# EAGLE design Ekogolf-board (EAGLE 9.4.2)
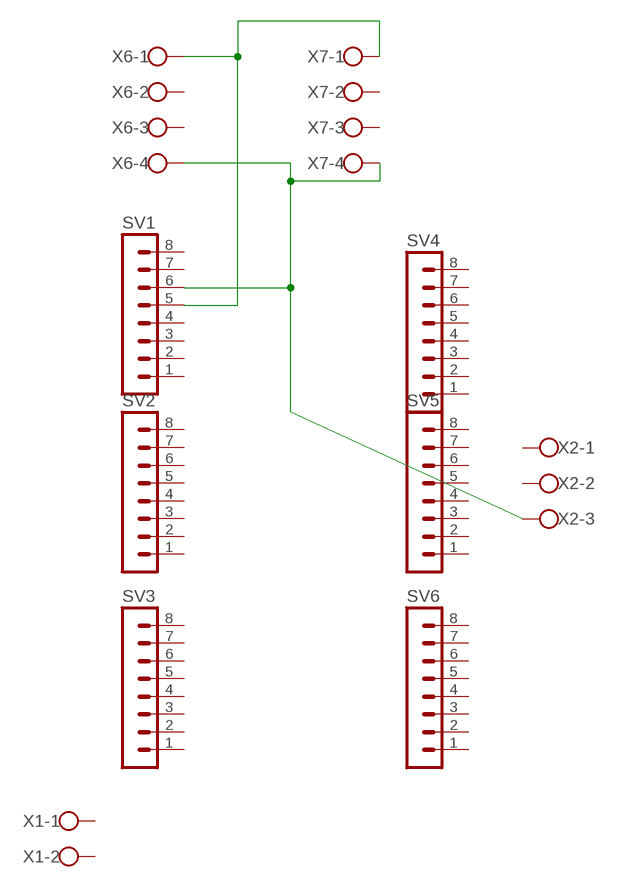
[diagram p0: schematic, sheet 1]

## Parts
SV1  MA08-1  [MA08-1]
SV2  MA08-1  [MA08-1]
SV3  MA08-1  [MA08-1]
SV4  MA08-1  [MA08-1]
SV5  MA08-1  [MA08-1]
SV6  MA08-1  [MA08-1]
X1  W237-102  [W237-102]
X2  W237-103  [W237-103]
X6  W237-4  [W237-4]
X7  W237-4  [W237-4]

## Nets
N$1: SV1.5 X6.1 X7.1
N$3: SV1.6 X2.3 X6.4 X7.4
Unconnected: SV1.1 SV1.2 SV1.3 SV1.4 SV1.7 SV1.8 SV2.1 SV2.2 SV2.3 SV2.4 SV2.5 SV2.6 SV2.7 SV2.8 SV3.1 SV3.2 SV3.3 SV3.4 SV3.5 SV3.6 SV3.7 SV3.8 SV4.1 SV4.2 SV4.3 SV4.4 SV4.5 SV4.6 SV4.7 SV4.8 SV5.1 SV5.2 SV5.3 SV5.4 SV5.5 SV5.6 SV5.7 SV5.8 SV6.1 SV6.2 SV6.3 SV6.4 SV6.5 SV6.6 SV6.7 SV6.8 X1.1 X1.2 X2.1 X2.2 X6.2 X6.3 X7.2 X7.3

## Library data of the parts
SV1-SV6 = con-lstb:MA08-1: PIN HEADER; OC_FARNELL: unknown; OC_NEWARK: unknown
X1 = con-wago-500:W237-102: WAGO SCREW CLAMP; MPN: 237-102; OC_FARNELL: unknown; OC_NEWARK: 70K9898
X2 = con-wago-500:W237-103: WAGO SCREW CLAMP; MPN: 237-103; OC_FARNELL: unknown; OC_NEWARK: 18M7116
X6 X7 = con-wago-500:W237-4: WAGO SCREW CLAMP; OC_FARNELL: unknown; OC_NEWARK: unknown

## Board
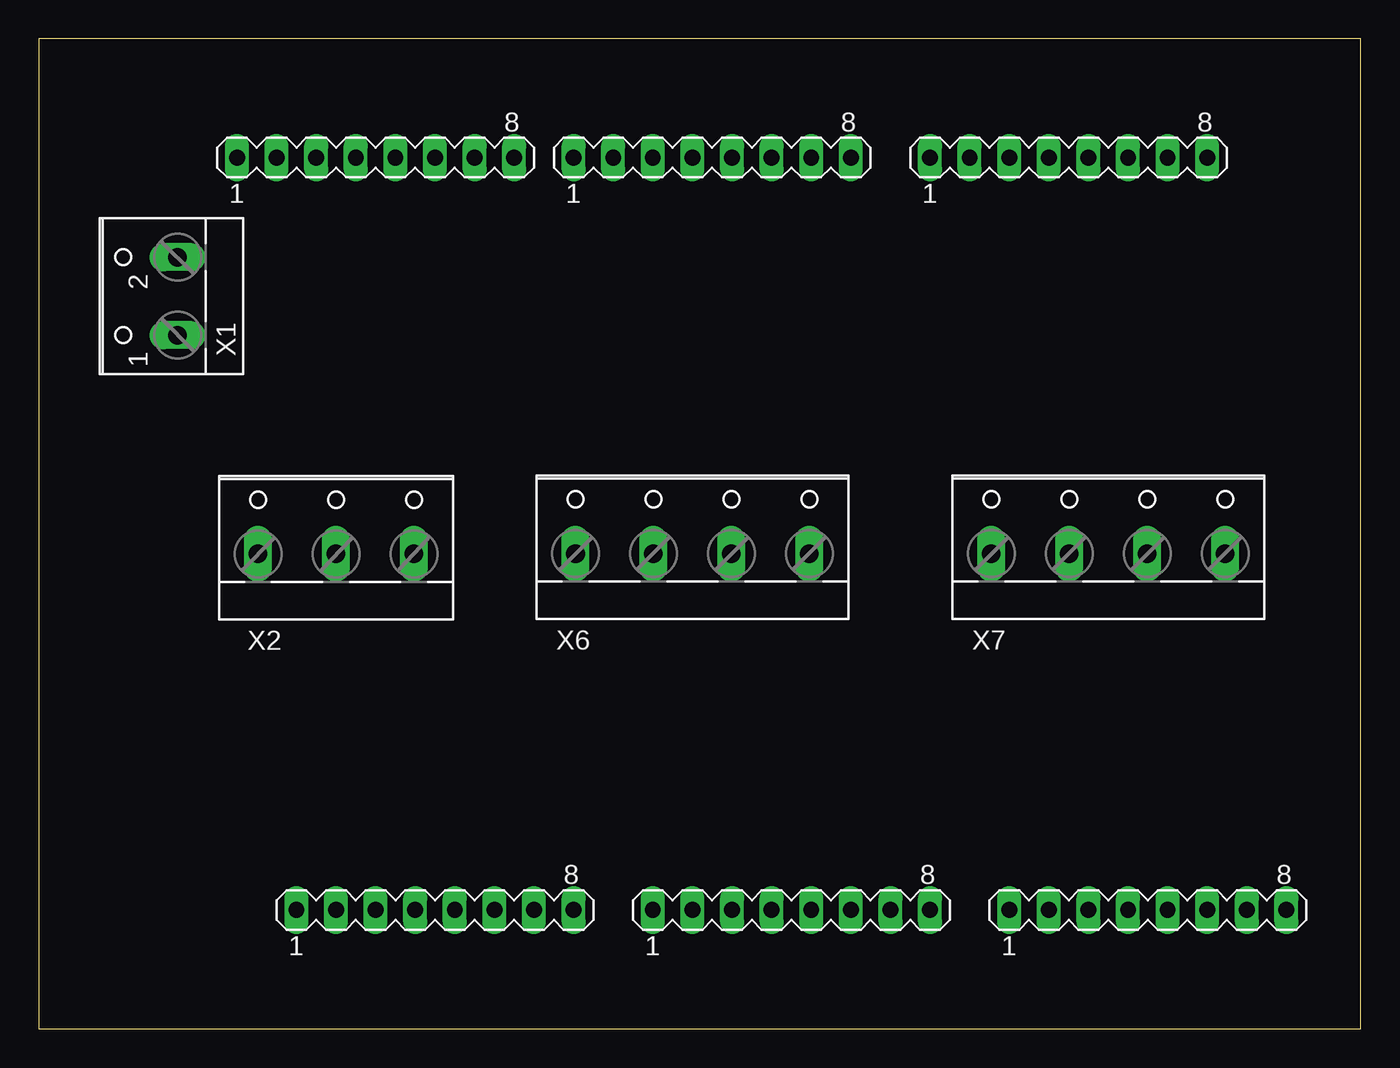
[diagram p1: board, top side]
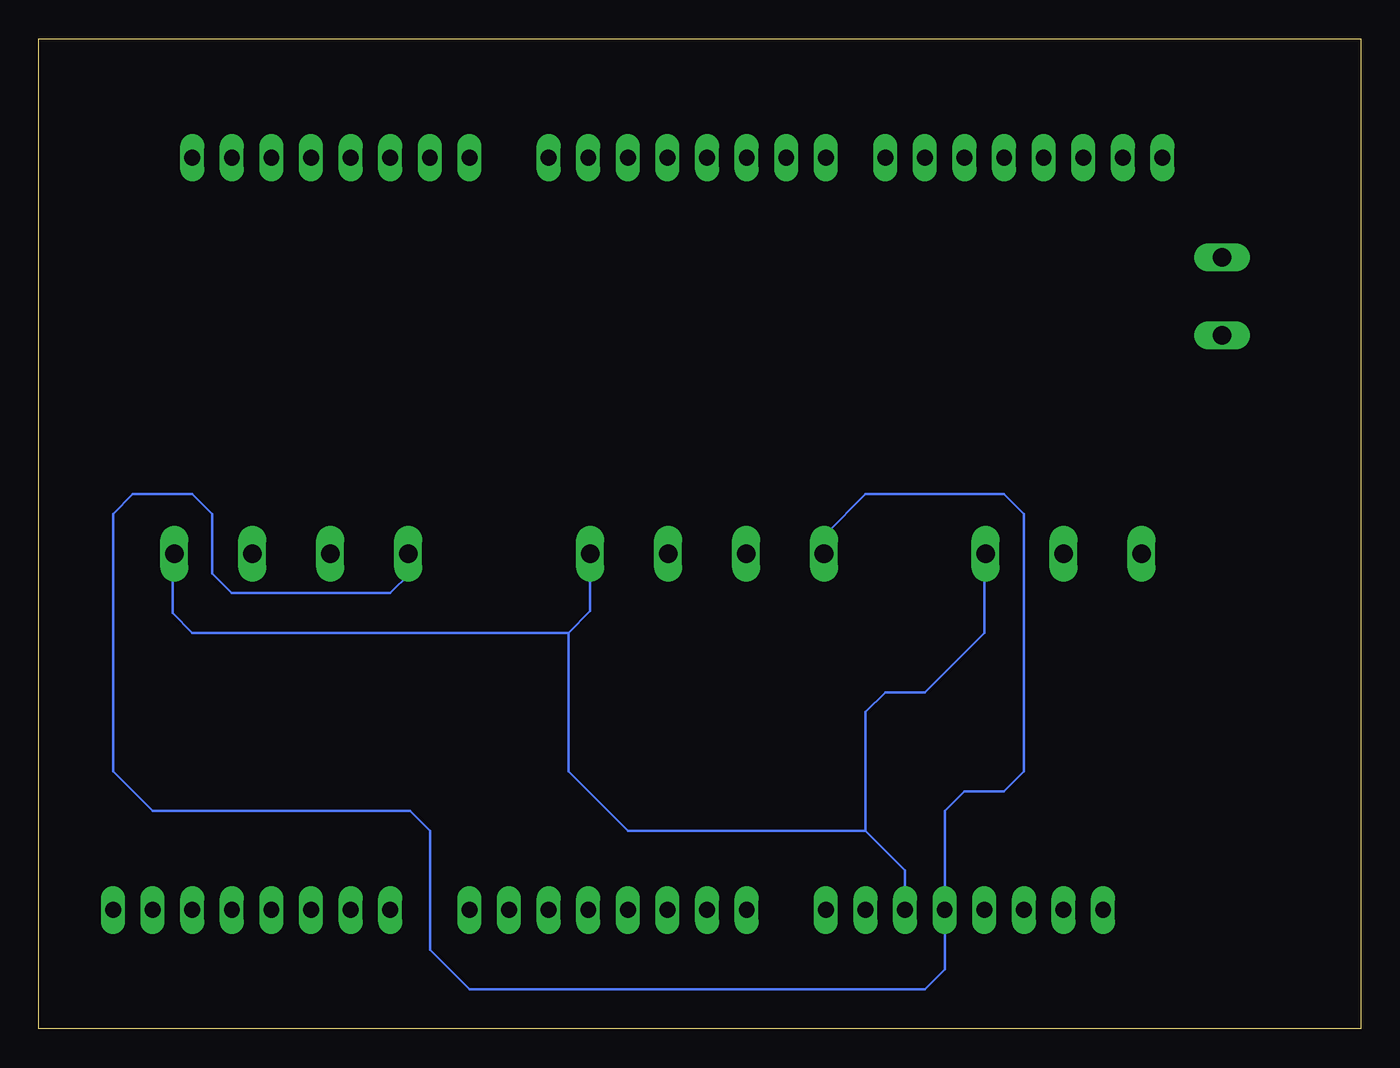
[diagram p2: board, bottom side, seen from below]

Size 84.76 x 63.49 mm. Coordinates in mm from the lower left corner, seen from the top.
Outline: 0,0 84.76,0 84.76,63.49 0,63.49 0,0
Copper layers (1*16): Top 0.035mm / dielectric 1.5mm / Bottom 0.035mm
Design rules "default": minimum track width 6mil, minimum drill 0.35mm, track to track 6mil, track to pad 6mil, pad to pad 6mil, via to via 6mil, smd to smd 6mil, copper to edge 40mil, drill to drill 6mil, minimum pad ring 10mil, minimum via ring 8mil, stop-mask expansion 4mil, vias tented up to drill 0mil, thermal gap 10mil

### Footprints (pad centres in the part's own frame; a part is rotated, then mirrored left to right if it is on the bottom)
MA08-1 = drill 1.016 long: 1 -8.89,0; 2 -6.35,0; 3 -3.81,0; 4 -1.27,0; 5 1.27,0; 6 3.81,0; 7 6.35,0; 8 8.89,0
W237-102 = drill 1.194 long: 1 -2.5,-1.27; 2 2.5,-1.27
W237-103 = drill 1.194 long: 1 -5,-1.29; 2 0,-1.29; 3 5,-1.29
W237-4 = drill 1.194 long: 1 -7.5,-1.27; 2 -2.5,-1.27; 3 2.5,-1.27; 4 7.5,-1.27

### Placement (x,y rotation side)
SV1  25.4,7.62 0 top
SV2  48.26,7.62 0 top
SV3  71.12,7.62 0 top
SV4  21.59,55.88 0 top
SV5  43.18,55.88 0 top
SV6  66.04,55.88 0 top
X1  7.62,46.99 90 top
X2  19.05,31.75 0 top
X6  41.91,31.75 0 top
X7  68.58,31.75 0 top

### Tracks (layer width: path | path; a pad name or v marks a point on that pad's centre or on a via)
N$1
  Bottom 0.152: X7.1 61.08,29.33 60.96,29.21 62.23,27.94 72.39,27.94 73.66,29.21 73.66,33.02 74.93,34.29 78.74,34.29 80.01,33.02 80.01,16.51 77.47,13.97 60.96,13.97 59.69,12.7 59.69,5.08 57.15,2.54 27.94,2.54 26.67,3.81 SV1.5 26.67,13.97 25.4,15.24 22.86,15.24 21.59,16.51 21.59,33.02 22.86,34.29 31.75,34.29 34.29,31.75 34.29,30.6 X6.1
N$3
  Bottom 0.152: X6.4 49.41,26.79 50.8,25.4 | X7.4 76.2,30.36 76.2,26.67 74.93,25.4 50.8,25.4 | SV1.6 29.21,10.16 31.75,12.7 | 31.75,12.7 46.99,12.7 50.8,16.51 50.8,25.4 | X2.3 24.13,30.38 24.13,25.4 27.94,21.59 30.48,21.59 31.75,20.32 31.75,12.7